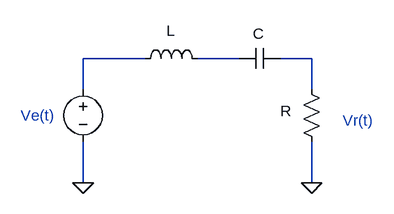
[diagram p0: schematic rlc.asc]
rlc.asc, the LTspice schematic file:
Version 4
SHEET 1 880 680
WIRE 0 96 -96 96
WIRE 144 96 80 96
WIRE 256 96 208 96
WIRE -96 144 -96 96
WIRE 256 144 256 96
WIRE -96 288 -96 224
WIRE 256 288 256 224
FLAG 256 288 0
FLAG -96 288 0
SYMBOL cap 208 80 R90
WINDOW 0 0 32 Invisible 2
WINDOW 3 -38 34 VTop 2
SYMATTR InstName C1
SYMBOL ind -16 112 R270
WINDOW 0 32 56 Invisible 2
WINDOW 3 74 55 VBottom 2
SYMATTR InstName L1
SYMBOL res 240 128 R0
WINDOW 0 36 40 Invisible 2
WINDOW 3 -32 49 Left 2
SYMATTR InstName R1
SYMBOL voltage -96 128 R0
WINDOW 0 24 16 Invisible 2
WINDOW 3 24 96 Invisible 2
WINDOW 123 0 0 Left 0
WINDOW 39 0 0 Left 0
SYMATTR InstName Ven
SYMATTR Value 1
TEXT 304 192 Left 2 ;Vr(t)
TEXT -192 184 Left 2 ;Ve(t)

The netlist it stands for:
* rlc.asc
C1 N003 N002 C
L1 N001 N002 L
R1 N003 0 R
Ven N001 0 1
* Vr(t)
* Ve(t)
.backanno
.end